# EAGLE design driver-ha-v5 (EAGLE 6.5.0)
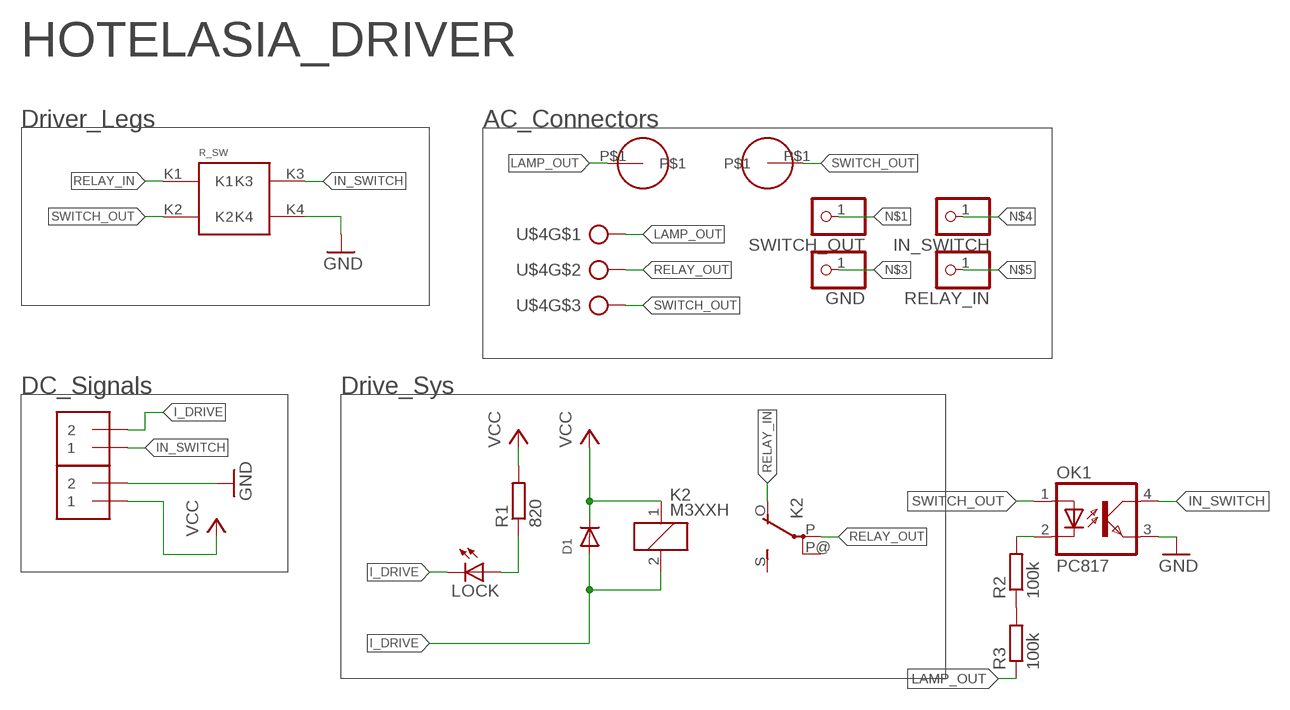
[diagram p0: schematic, sheet 1]

## Parts
D1  DIODESMA  [SMADIODE]
GND  PINHD-1X1  [1X01]
IN_SWITCH  PINHD-1X1  [1X01]
J1  1X2-3.5MM  [1X2-3.5MM]
J2  1X2-3.5MM  [1X2-3.5MM]
K2  M3XXH  [M3XXH]
LOCK  LED3MM  [LED3MM]
OK1  PC817  [DIL04]
PAD1  ROOM_SWITCH  [ROOM_SWITCH]
R1  820  R-EU_R0805  [R0805]
R2  100k  R-EU_R1206  [R1206]
R3  100k  R-EU_R1206  [R1206]
RELAY_IN  PINHD-1X1  [1X01]
SWITCH_OUT  PINHD-1X1  [1X01]
U$1  CONN-CABLE  [CONN-CABLE]
U$3  CONN-CABLE  [CONN-CABLE]
U$4  AK3003  [AK3003]

## Nets
GND: J2.2 OK1.3(EMIT) PAD1.K4
I_DRIVE: D1.A J1.2 K2.2 LOCK.K(C)
IN_SWITCH: J1.1 OK1.4(COL) PAD1.K3
LAMP_OUT: R3.1 U$1.P$1 U$4.1
N$1: SWITCH_OUT.1
N$2: LOCK.A R1.1
N$3: GND.1
N$4: IN_SWITCH.1
N$5: RELAY_IN.1
N$6: R2.1 R3.2
N$7: OK1.2(C) R2.2
RELAY_IN: K2.O(2:O) PAD1.K1
RELAY_OUT: K2.P(2:P) U$4.2
SWITCH_OUT: OK1.1(A) PAD1.K2 U$3.P$1 U$4.3
VCC: D1.C J2.1 K2.1 R1.2
Unconnected: K2.P@(2:P) K2.S(2:S)

## Notes on the sheet
- HOTELASIA_DRIVER
- Driver_Legs | AC_Connectors
- DC_Signals | Drive_Sys

## Library data of the parts
D1 = adafruit:DIODE: Diode SMADIODE - SMA Surface Mount Package 20V 1A Schottky Diode Digikey: 641-1014-6-ND DO-1N4148 - Through Hole Small Current Diode SOD-123 20V 1 A (.5mV Vf) Schottky Diode - Digikey: MBRX120TPMSCT-ND SOD-323 10V 570mA (.38mV Vf, 3ns) Schottky Diode - Digikey: ZLLS410CT-ND SOD-523 30V 30mA Schottky Diode (RB751S-40TE61) - Digikey: RB751S-40TE61CT-ND SOT23-R/W - SOT23 Package (R = Solder Paste/Reflow Ovens, W = Hand-Soldering) BAT54Film 40V 300mA - Digikey: 497-7162-1-ND
GND IN_SWITCH RELAY_IN SWITCH_OUT = pinhead:PINHD-1X1: PIN HEADER
J1 J2 = adafruit:1X2: 3.5mm Terminal block http://www.ladyada.net/library/pcb/eaglelibrary.html
K2 = relay:M3XXH: RELAY 1 x switch; OC_FARNELL: unknown; OC_NEWARK: unknown
LOCK = adafruit:LED: LED OSRAM: - CHIPLED LG R971, LG N971, LY N971, LG Q971, LY Q971, LO R971, LY R971 LH N974, LH R974 LS Q976, LO Q976, LY Q976 LO Q996 - Hyper CHIPLED LW Q18S LB Q993, LB Q99A, LB R99A - SideLED LS A670, LO A670, LY A670, LG A670, LP A670 LB A673, LV A673, LT A673, LW A673 LH A674 LY A675 LS A676, LA A676, LO A676, LY A676, LW A676 LS A679, LY A679, LG A679 - Hyper Micro SIDELED® LS Y876, LA Y876, LO Y876, LY Y876 LT Y87S - SmartLED LW L88C, LW L88S LB L89C, LB L89S, LG L890 LS L89K, LO L89K, LY L89K LS L896, LA L896, LO L896, LY L896 - TOPLED LS T670, LO T670, LY T670, LG T670, LP T670 LSG T670, LSP T670, LSY T670, LOP T670, LYG T670 LG T671, LOG T671, LSG T671 LB T673, LV T673, LT T673, LW T673 LH T674 LS T676, LA T676, LO T676, LY T676, LB T676, LH T676, LSB T676, LW T676 LB T67C, LV T67C, LT T67C, LS T67K, LO T67K, LY T67K, LW E67C LS E67B, LA E67B, LO E67B, LY E67B, LB E67C, LV E67C, LT E67C LW T67C LS T679, LY T679, LG T679 LS T770, LO T770, LY T770, LG T770, LP T770 LB T773, LV T773, LT T773, LW T773 LH T774 LS E675, LA E675, LY E675, LS T675 LS T776, LA T776, LO T776, LY T776, LB T776 LHGB T686 LT T68C, LB T68C - Hyper Mini TOPLED® LB M676 - Mini TOPLED Santana® LG M470 LS M47K, LO M47K, LY M47K Source: http://www.osram.convergy.de/
OK1 = optocoupler:PC817: SHARP OPTO COUPLER; MPN: PC817X4J000F; OC_FARNELL: 9707727; OC_NEWARK: 97K7059
PAD1 = maul:ROOM_SWITCH
R1-R3 = resistor:R-EU_: RESISTOR, European symbol
U$1 U$3 = bontor:CONN-CABLE
U$4 = con-ptr500:AK3003

## Net classes
0 default: width 0.305 mm, drill 0.508 mm, clearance 5.08 mm

## Board
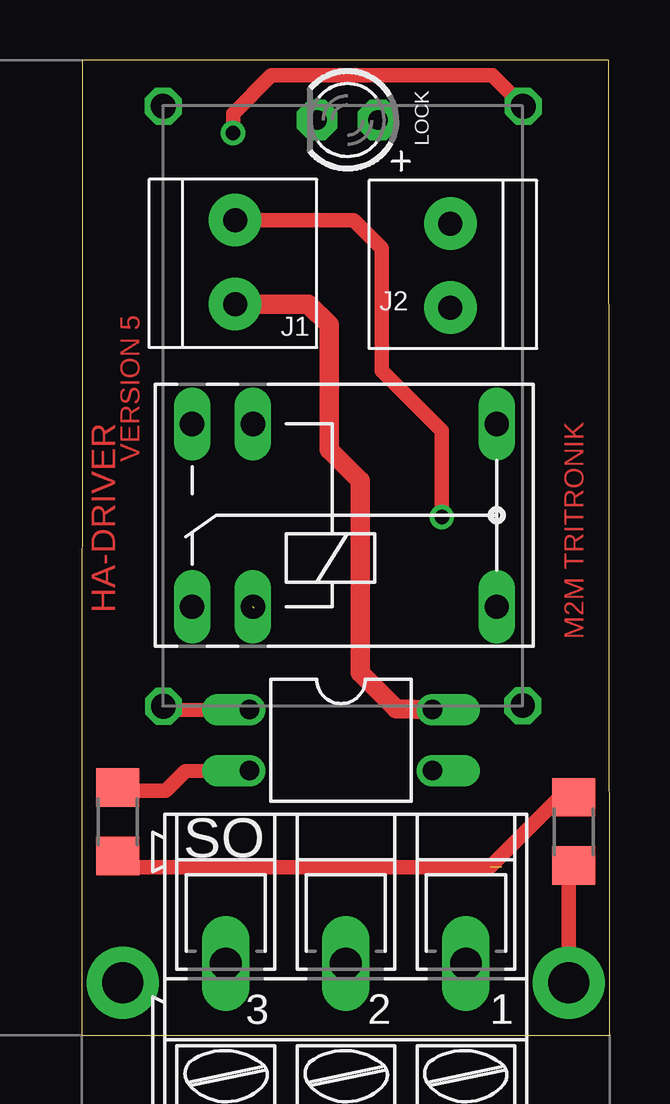
[diagram p1: board, top side]
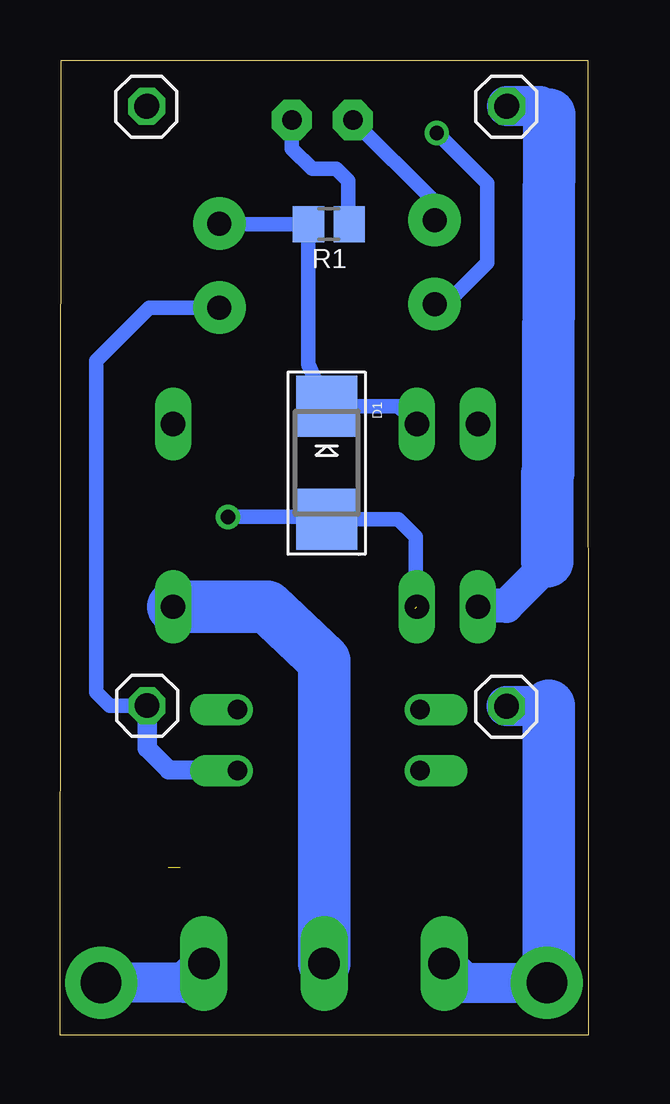
[diagram p2: board, bottom side, seen from below]

Size 22 x 40.64 mm. Coordinates in mm from the lower left corner, seen from the top.
Outline: 21.95,40.64 0.02,40.64 0,0 22,0 21.95,40.64
Copper layers (1*16): Top 0.035mm / dielectric 1.5mm / Bottom 0.035mm
Design rules "default": minimum track width 10mil, minimum drill 24mil, track to track 8mil, track to pad 8mil, pad to pad 8mil, via to via 8mil, smd to smd 8mil, copper to edge 40mil, drill to drill 8mil, minimum pad ring 10mil, minimum via ring 8mil, stop-mask expansion 4mil, vias tented up to drill 0mil, thermal gap 10mil

### Footprints (pad centres in the part's own frame; a part is rotated, then mirrored left to right if it is on the bottom)
SMADIODE = smd 2.54 x 2.54: A 2.349,0; C -2.349,0
1X01 = drill 1.016 octagon: 1 0,0
1X2-3.5MM = drill 1 pad 2.184: 1 1.8,0; 2 -1.7,0
M3XXH = drill 1.016 long: 1 -3.81,3.81; 2 -3.81,-3.81; O -6.35,-3.81; P 6.35,-3.81; P@ 6.35,3.81; S -6.35,3.81
LED3MM = drill 0.813 pad 1.676 octagon: A -1.27,0; K 1.27,0
DIL04 = drill 0.813 offset: 1 -1.27,-3.81; 2 1.27,-3.81; 3 1.27,3.81; 4 -1.27,3.81
ROOM_SWITCH = drill 1 octagon: K1 -7.365,12.825; K2 -7.335,-12.175; K3 7.635,12.825; K4 7.635,-12.175
R0805 = smd 1.3 x 1.5: 1 -0.85,0; 2 0.85,0
R1206 = smd 1.6 x 1.803: 1 -1.422,0; 2 1.422,0
CONN-CABLE = drill 1.7 pad 3: P$1 0,0
AK3003 = drill 1.321 long: 1 -5.004,0; 2 0,0; 3 5.004,0

### Placement (x,y rotation side)
D1  10.89,23.86 270 bottom
GND  18.37,13.74 0 bottom
IN_SWITCH  18.4,38.7 0 bottom
J1  6.39,32.27 270 top
J2  15.36,32.02 90 top
K2  10.94,21.67 0 top
LOCK  11.07,38.14 180 top
OK1  10.8,12.3 270 top
PAD1  10.73,25.9 0 top
R1  10.8,33.8 180 bottom
R2  1.5,8.9 90 top
R3  20.5,8.5 90 top
RELAY_IN  3.4,38.7 0 bottom
SWITCH_OUT  3.4,13.7 0 bottom
U$1  20.29,2.19 180 top
U$3  1.71,2.19 180 top
U$4  11,3 180 top

### Tracks (layer width: path | path; a pad name or v marks a point on that pad's centre or on a via)
GND
  Bottom 0.61: J2.2 18.28,30.32 20.5,28.1 20.5,14.3 19.93,13.72 PAD1.K4
  Bottom 0.813: OK1.3 17.46,11.06 18.36,11.96 PAD1.K4
I_DRIVE  (via drill 0.6)  (1 unrouted)
  Top 0.61: J1.2 11.33,33.97 12.5,32.8 12.5,27.7 15,25.2 v15,21.6
  Bottom 0.61: LOCK.K 6.39,34.73 J1.2 | 7.19,17.8 7.18,20.4 7.18,20.78 7.91,21.51 D1.A 10.98,21.6 v15,21.6
IN_SWITCH  (via drill 0.6)
  Top 0.61: v6.3,37.6 6.3,38.4 7.9,40 17.09,40 PAD1.K3
  Top 0.813: OK1.4 13.1,13.6 11.6,15.1 11.6,23.1 10.3,24.4 10.3,29.6 9.43,30.47 J1.1
  Bottom 0.61: J1.1 5.93,30.47 4.2,32.2 4.2,35.5 v6.3,37.6
LAMP_OUT
  Top 0.61: U$1.P$1 20.29,6.87 R3.1
  Bottom 1.676: U$4.1 16.81,2.19 U$1.P$1
N$2
  Bottom 0.61: LOCK.A 12.34,36.94 11.5,36.1 10.5,36.1 10,35.6 10,33.85 R1.1
N$6  (1 unrouted)
  Top 0.61: R2.1 1.98,7 17,7 19.92,9.92 R3.2
N$7
  Top 0.61: R2.2 1.95,10.2 3.5,10.2 4.3,11 OK1.2
RELAY_IN
  Bottom 1.422: 1.7,19.75 1.7,19.6 3.4,17.9 4.55,17.9 K2.O
  Bottom 1.676: PAD1.K1 2,38.73 1.61,38.36
  Bottom 2.184: 1.61,38.36 1.65,26.95 1.65,23.45 1.7,23.4 1.7,19.75
RELAY_OUT
  Bottom 2.184: U$4.2 11,15.6 13.36,17.86 K2.P
SWITCH_OUT
  Top 0.61: PAD1.K2 3.61,13.54 OK1.1
  Bottom 1.676: PAD1.K2 1.65,13.72 1.63,13.74 | U$4.3 5.19,2.19 U$3.P$1
  Bottom 2.184: 1.63,13.74 1.63,2.27
  Bottom 2.54: 1.63,2.27 U$3.P$1
VCC
  Bottom 0.61: J2.1 15.84,33.8 R1.2 11.65,27.97 D1.C 7.9,26.21 K2.1

### Text on the board
Top: VERSION 5 | HA-DRIVER | M2M TRITRONIK
tNames: SO
tValues: RO | LO